# Altium schematic sheet [01] - COVER PAGE.SchDoc
size A3; DocumentNumber: 1; SheetNumber: 2; SheetTotal: 9
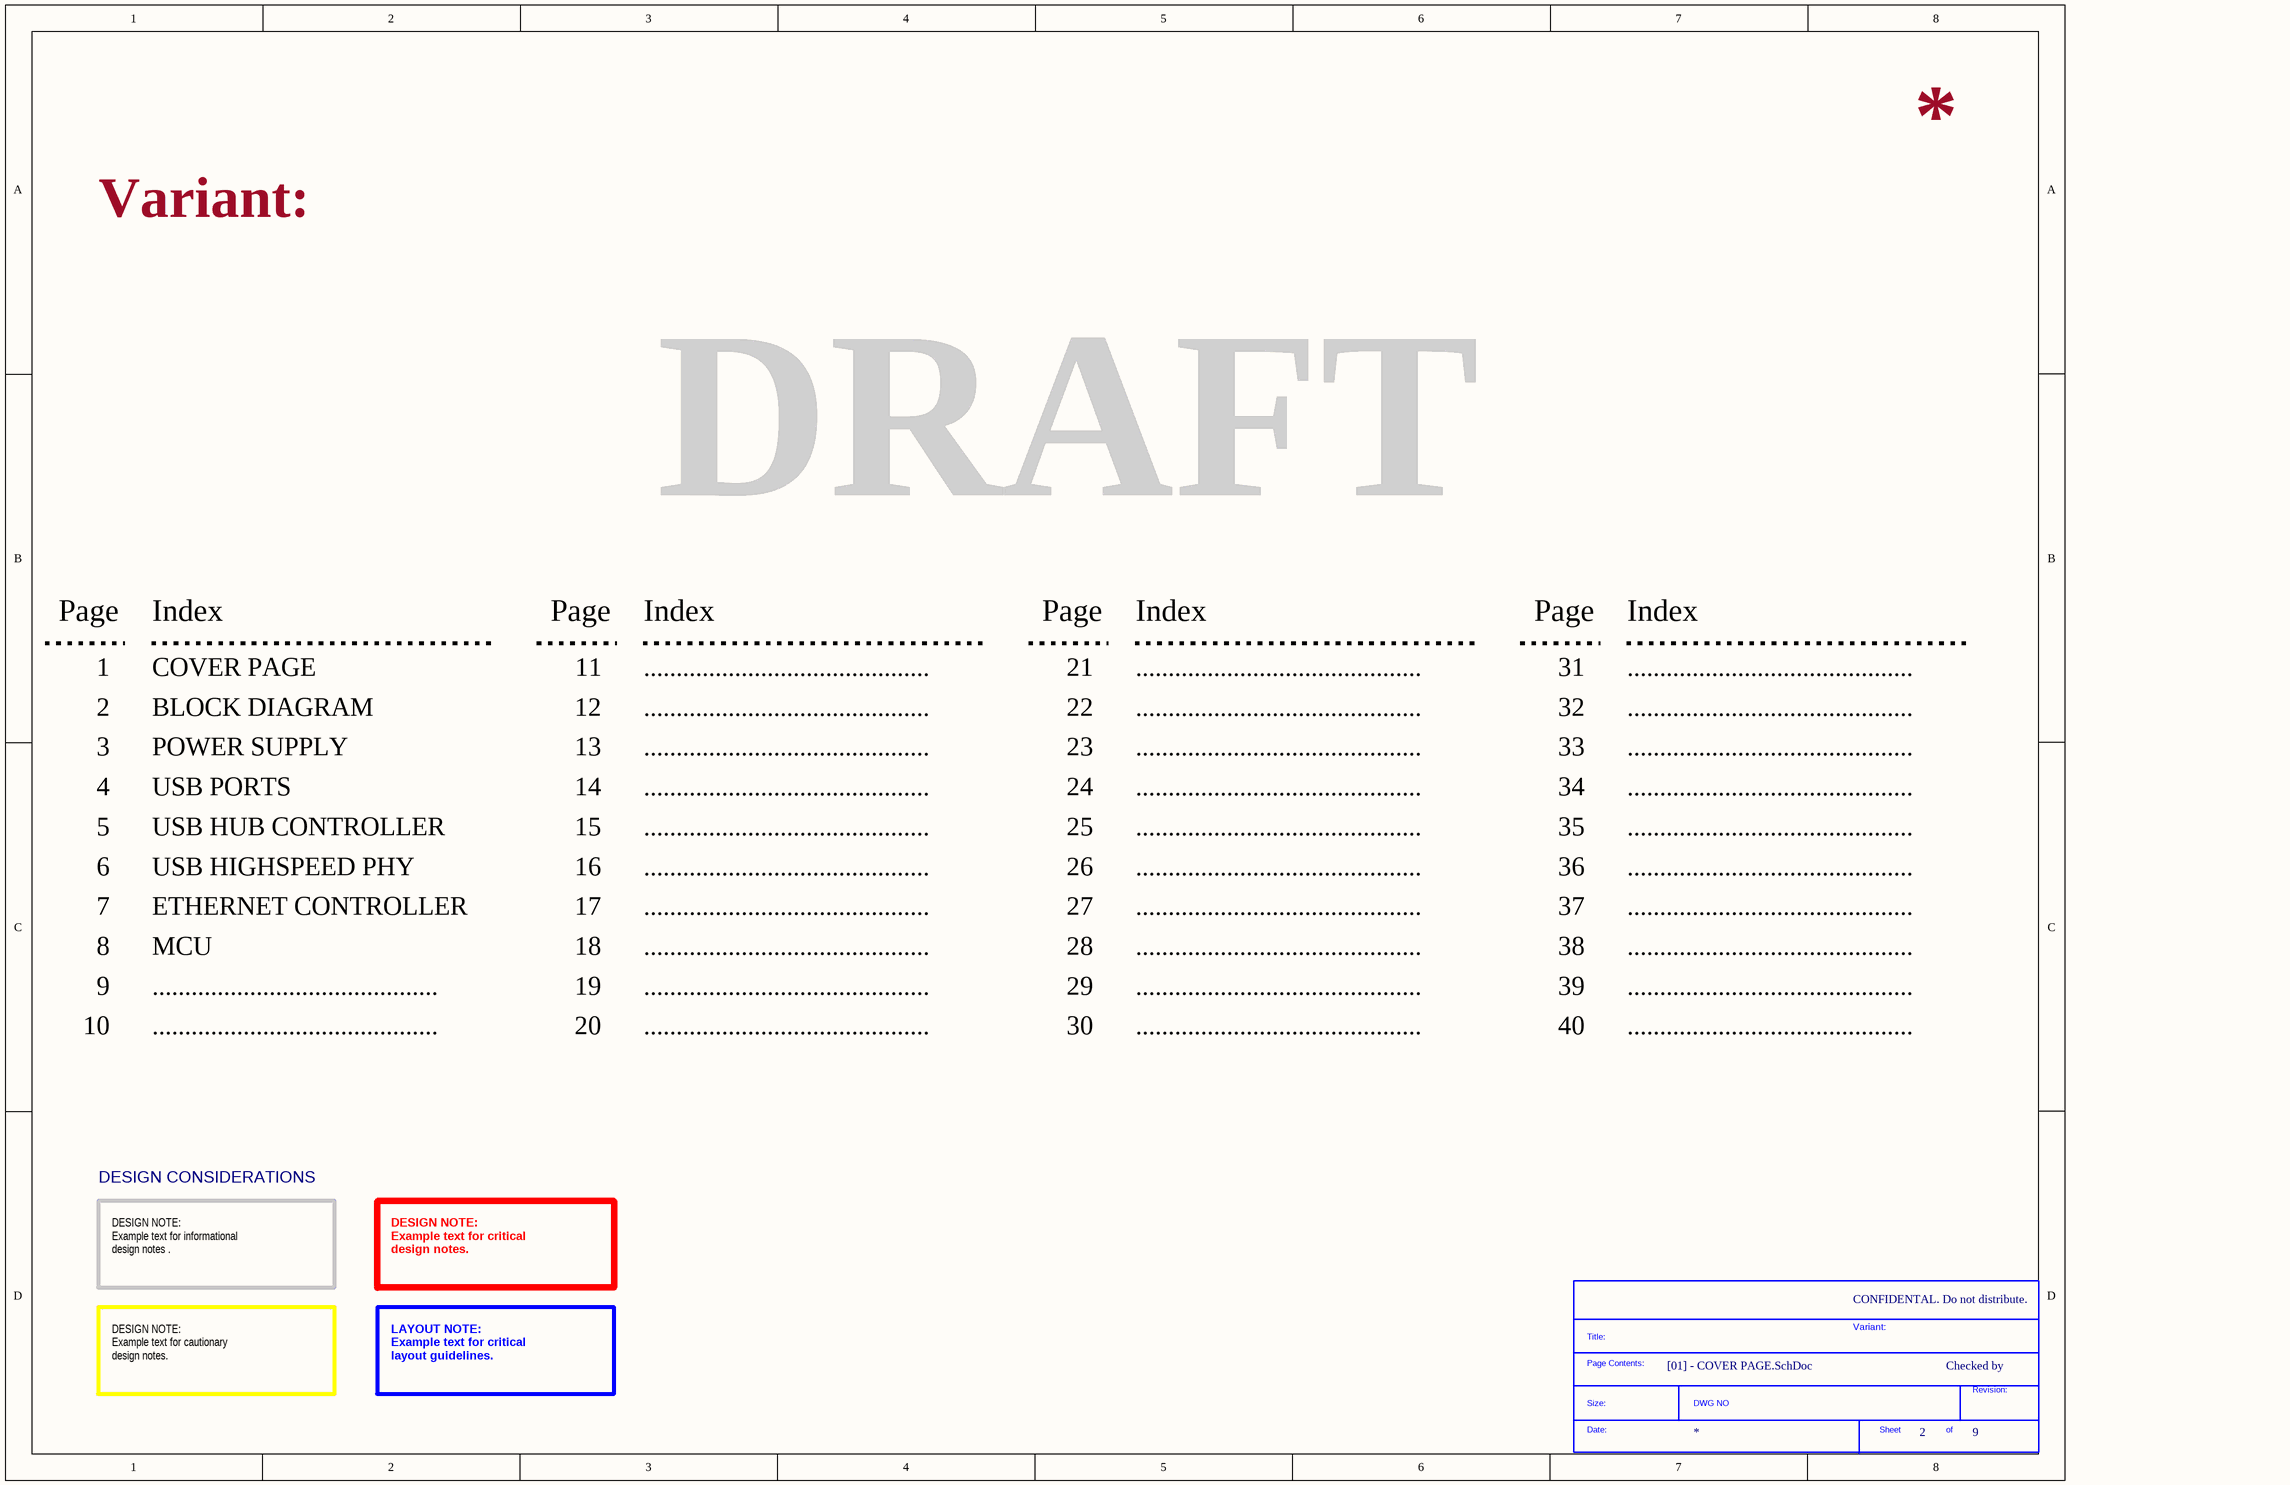
[diagram p0: [01] - COVER PAGE.SchDoc]

## Parts
*  SDTitleBlock  (value not drawn)  (graphical)

## Notes on the sheet
- Variant:
- DRAFT
- Page
- Index
- 1
- COVER PAGE
- 11
- ............................................
- 21
- 31
- 2
- 3
- BLOCK DIAGRAM
- POWER SUPPLY
- 12
- 13
- 22
- 23
- 32
- 33
- 4
- 5
- USB PORTS
- USB HUB CONTROLLER
- 14
- 15
- 24
- 25
- 34
- 35
- 6
- USB HIGHSPEED PHY
- 16
- 26
- 36
- 7
- 8
- ETHERNET CONTROLLER
- MCU
- 17
- 18
- 27
- 28
- 37
- 38
- 9
- 10
- 19
- 20
- 29
- 30
- 39
- 40
- DESIGN CONSIDERATIONS
- DESIGN NOTE:
  Example text for informational
  design notes .
- DESIGN NOTE:
  Example text for critical
  design notes.
- CONFIDENTAL. Do not distribute.
- Checked by
- DESIGN NOTE:
  Example text for cautionary
  design notes.
- LAYOUT NOTE:
  Example text for critical
  layout guidelines.
- (in symbol SDTitleBlock) Title:; Page Contents:; Revision:; Size:; DWG NO; Date:; Sheet; of